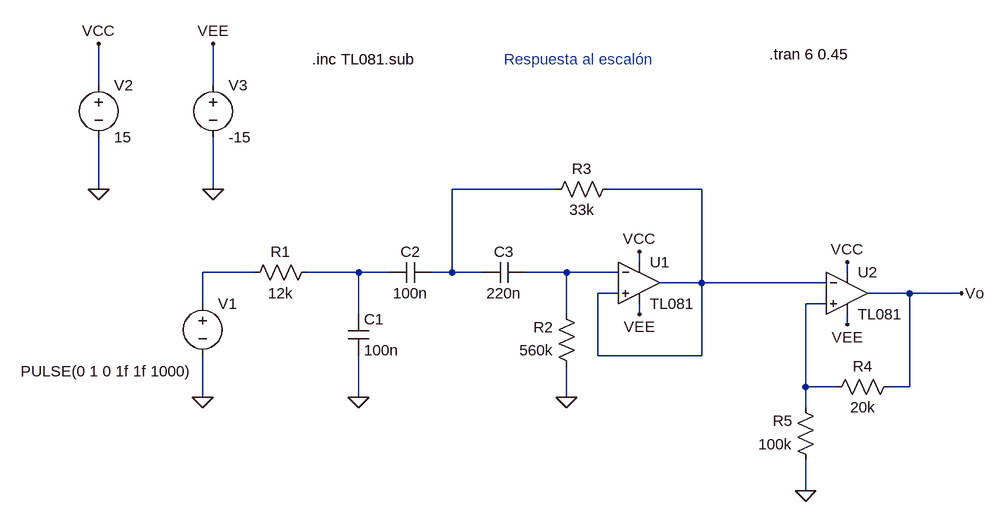
[diagram p0: schematic rtaEscalon.asc]
rtaEscalon.asc, the LTspice schematic file:
Version 4
SHEET 1 1176 704
WIRE -400 64 -400 0
WIRE -224 64 -224 0
WIRE -400 224 -400 144
WIRE -224 224 -224 144
WIRE 304 224 144 224
WIRE 528 224 384 224
WIRE 432 336 432 320
WIRE -160 352 -240 352
WIRE 0 352 -80 352
WIRE 48 352 0 352
WIRE 144 352 144 224
WIRE 144 352 112 352
WIRE 192 352 144 352
WIRE 320 352 256 352
WIRE 400 352 320 352
WIRE 752 352 752 336
WIRE 528 368 528 224
WIRE 528 368 464 368
WIRE 720 368 528 368
WIRE 400 384 368 384
WIRE 848 384 784 384
WIRE 928 384 848 384
WIRE -240 400 -240 352
WIRE 720 400 688 400
WIRE 0 416 0 352
WIRE 320 416 320 352
WIRE 432 416 432 400
WIRE 752 432 752 416
WIRE 368 480 368 384
WIRE 528 480 528 368
WIRE 528 480 368 480
WIRE 688 528 688 400
WIRE 736 528 688 528
WIRE 848 528 848 384
WIRE 848 528 816 528
WIRE -240 544 -240 480
WIRE 0 544 0 480
WIRE 320 544 320 496
WIRE 688 560 688 528
WIRE 688 688 688 640
FLAG -240 544 0
FLAG -400 224 0
FLAG -400 0 VCC
FLAG -224 224 0
FLAG -224 0 VEE
FLAG 0 544 0
FLAG 320 544 0
FLAG 432 320 VCC
FLAG 432 416 VEE
FLAG 752 336 VCC
FLAG 752 432 VEE
FLAG 688 688 0
FLAG 928 384 Vo
SYMBOL Voltage -240 384 R0
WINDOW 3 -280 120 Left 2
SYMATTR Value PULSE(0 1 0 1f 1f 1000)
SYMATTR InstName V1
SYMBOL Voltage -400 48 R0
SYMATTR InstName V2
SYMATTR Value 15
SYMBOL Voltage -224 48 R0
SYMATTR InstName V3
SYMATTR Value -15
SYMBOL Cap -16 416 R0
SYMATTR InstName C1
SYMATTR Value 100n
SYMATTR SpiceLine IC=0
SYMBOL Cap 112 336 R90
WINDOW 0 0 32 VBottom 2
WINDOW 3 32 32 VTop 2
SYMATTR InstName C2
SYMATTR Value 100n
SYMATTR SpiceLine IC=0
SYMBOL Cap 256 336 R90
WINDOW 0 0 32 VBottom 2
WINDOW 3 32 32 VTop 2
SYMATTR InstName C3
SYMATTR Value 220n
SYMATTR SpiceLine IC=0
SYMBOL Res -64 336 R90
WINDOW 0 0 56 VBottom 2
WINDOW 3 32 56 VTop 2
SYMATTR InstName R1
SYMATTR Value 12k
SYMBOL Res 336 512 R180
WINDOW 0 36 76 Left 2
WINDOW 3 36 40 Left 2
SYMATTR InstName R2
SYMATTR Value 560k
SYMBOL Res 288 240 R270
WINDOW 0 32 56 VTop 2
WINDOW 3 0 56 VBottom 2
SYMATTR InstName R3
SYMATTR Value 33k
SYMBOL OpAmps/opamp2 432 304 R0
SYMATTR InstName U1
SYMATTR Value TL081
SYMBOL OpAmps/opamp2 752 320 R0
SYMATTR InstName U2
SYMATTR Value TL081
SYMBOL Res 832 512 R90
WINDOW 0 0 56 VBottom 2
WINDOW 3 32 56 VTop 2
SYMATTR InstName R4
SYMATTR Value 20k
SYMBOL Res 704 656 R180
WINDOW 0 36 76 Left 2
WINDOW 3 36 40 Left 2
SYMATTR InstName R5
SYMATTR Value 100k
TEXT -72 24 Left 2 !.inc TL081.sub
TEXT 632 16 Left 2 !.tran 6 0.45
TEXT 224 24 Left 2 ;Respuesta al escalón

The netlist it stands for:
* rtaEscalon.asc
V1 N003 0 PULSE(0 1 0 1f 1f 1000)
V2 VCC 0 15
V3 VEE 0 -15
C1 N004 0 100n IC=0
C2 N001 N004 100n IC=0
C3 N005 N001 220n IC=0
R1 N004 N003 12k
R2 0 N005 560k
R3 N001 N002 33k
XU1 N002 N005 VCC VEE N002 TL081  ; pins In+ In- V+ V- OUT
XU2 N006 N002 VCC VEE Vo TL081  ; pins In+ In- V+ V- OUT
R4 Vo N006 20k
R5 0 N006 100k
.inc TL081.sub
.tran 6 0.45
* Respuesta al escalón
.backanno
.end